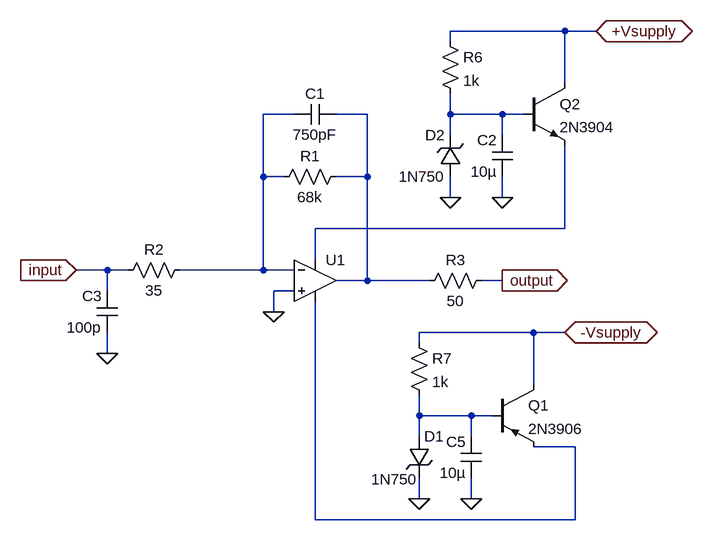
[diagram p0: schematic CR-110-R2.asc]
CR-110-R2.asc, the LTspice schematic file:
Version 4
SHEET 1 1264 680
WIRE 464 -352 288 -352
WIRE 512 -352 464 -352
WIRE 288 -336 288 -352
WIRE 464 -272 464 -352
WIRE 48 -224 0 -224
WIRE 160 -224 112 -224
WIRE 288 -224 288 -256
WIRE 368 -224 288 -224
WIRE 400 -224 368 -224
WIRE 288 -192 288 -224
WIRE 368 -192 368 -224
WIRE 0 -128 0 -224
WIRE 32 -128 0 -128
WIRE 160 -128 160 -224
WIRE 160 -128 112 -128
WIRE 288 -96 288 -128
WIRE 368 -96 368 -128
WIRE 464 -48 464 -176
WIRE 464 -48 80 -48
WIRE 80 0 80 -48
WIRE -240 16 -288 16
WIRE -208 16 -240 16
WIRE 0 16 0 -128
WIRE 0 16 -128 16
WIRE 48 16 0 16
WIRE 160 32 160 -128
WIRE 160 32 112 32
WIRE 256 32 160 32
WIRE 368 32 336 32
WIRE -240 48 -240 16
WIRE 48 48 16 48
WIRE 16 80 16 48
WIRE 416 112 240 112
WIRE 464 112 416 112
WIRE 240 128 240 112
WIRE -240 144 -240 112
WIRE 416 192 416 112
WIRE 240 240 240 208
WIRE 320 240 240 240
WIRE 352 240 320 240
WIRE 240 272 240 240
WIRE 320 272 320 240
WIRE 480 288 416 288
WIRE 240 368 240 336
WIRE 320 368 320 336
WIRE 80 400 80 64
WIRE 480 400 480 288
WIRE 480 400 80 400
FLAG -288 16 input
IOPIN -288 16 In
FLAG 368 32 output
IOPIN 368 32 Out
FLAG 16 80 0
FLAG -240 144 0
FLAG 464 112 -Vsupply
IOPIN 464 112 BiDir
FLAG 512 -352 +Vsupply
IOPIN 512 -352 BiDir
FLAG 288 -96 0
FLAG 240 368 0
FLAG 368 -96 0
FLAG 320 368 0
SYMBOL res 128 -144 R90
WINDOW 0 0 56 VBottom 2
WINDOW 3 32 56 VTop 2
SYMATTR InstName R1
SYMATTR Value 68k
SYMBOL cap 112 -240 R90
WINDOW 0 0 32 VBottom 2
WINDOW 3 32 32 VTop 2
SYMATTR InstName C1
SYMATTR Value 750pF
SYMBOL cap -224 112 R180
WINDOW 0 24 56 Left 2
WINDOW 3 24 8 Left 2
SYMATTR InstName C3
SYMATTR Value 100p
SYMBOL res 352 16 R90
WINDOW 0 0 56 VBottom 2
WINDOW 3 32 56 VTop 2
SYMATTR InstName R3
SYMATTR Value 50
SYMBOL Opamps\\UniversalOpamp2 80 32 R0
SYMATTR InstName U1
SYMATTR Value2 Avol=3000 GBW=300Meg Slew=1.4Meg
SYMATTR SpiceLine2 en=0 enk=0 in=0 ink=0 Rin=5000Meg
SYMBOL res -112 0 R90
WINDOW 0 0 56 VBottom 2
WINDOW 3 32 56 VTop 2
SYMATTR InstName R2
SYMATTR Value 35
SYMBOL pnp 352 192 R0
SYMATTR InstName Q1
SYMATTR Value 2N3906
SYMBOL npn 400 -272 R0
SYMATTR InstName Q2
SYMATTR Value 2N3904
SYMBOL res 272 -352 R0
SYMATTR InstName R6
SYMATTR Value 1k
SYMBOL res 224 112 R0
SYMATTR InstName R7
SYMATTR Value 1k
SYMBOL zener 224 272 R0
WINDOW 3 -58 66 Left 2
SYMATTR Value 1N750
SYMATTR InstName D1
SYMBOL zener 304 -128 R180
WINDOW 0 24 64 Left 2
WINDOW 3 24 0 Left 2
SYMATTR InstName D2
SYMATTR Value 1N750
SYMBOL cap 384 -128 R180
WINDOW 0 24 56 Left 2
WINDOW 3 24 8 Left 2
SYMATTR InstName C2
SYMATTR Value 10µ
SYMBOL cap 336 336 R180
WINDOW 0 24 56 Left 2
WINDOW 3 24 8 Left 2
SYMATTR InstName C5
SYMATTR Value 10µ

The netlist it stands for:
* CR-110-R2.asc
R1 N002 N001 68k
C1 N002 N001 750pF
C3 0 input 100p
R3 output N002 50
XU1 0 N001 N004 N006 N002 level.2 Avol=3000 GBW=300Meg Slew=1.4Meg ilimit=25m rail=0 Vos=0 phimargin=45 en=0 enk=0 in=0 ink=0 Rin=5000Meg  ; pins IN+ IN- V+ V- OUT
R2 N001 input 35
Q1 -Vsupply N005 N006 0 2N3906
Q2 +Vsupply N003 N004 0 2N3904
R6 +Vsupply N003 1k
R7 -Vsupply N005 1k
D1 N005 0 1N750
D2 0 N003 1N750
C2 0 N003 10µ
C5 0 N005 10µ
.model D D
.lib standard.dio
.model NPN NPN
.model PNP PNP
.lib standard.bjt
.lib UniversalOpamps2.sub
.backanno
.end